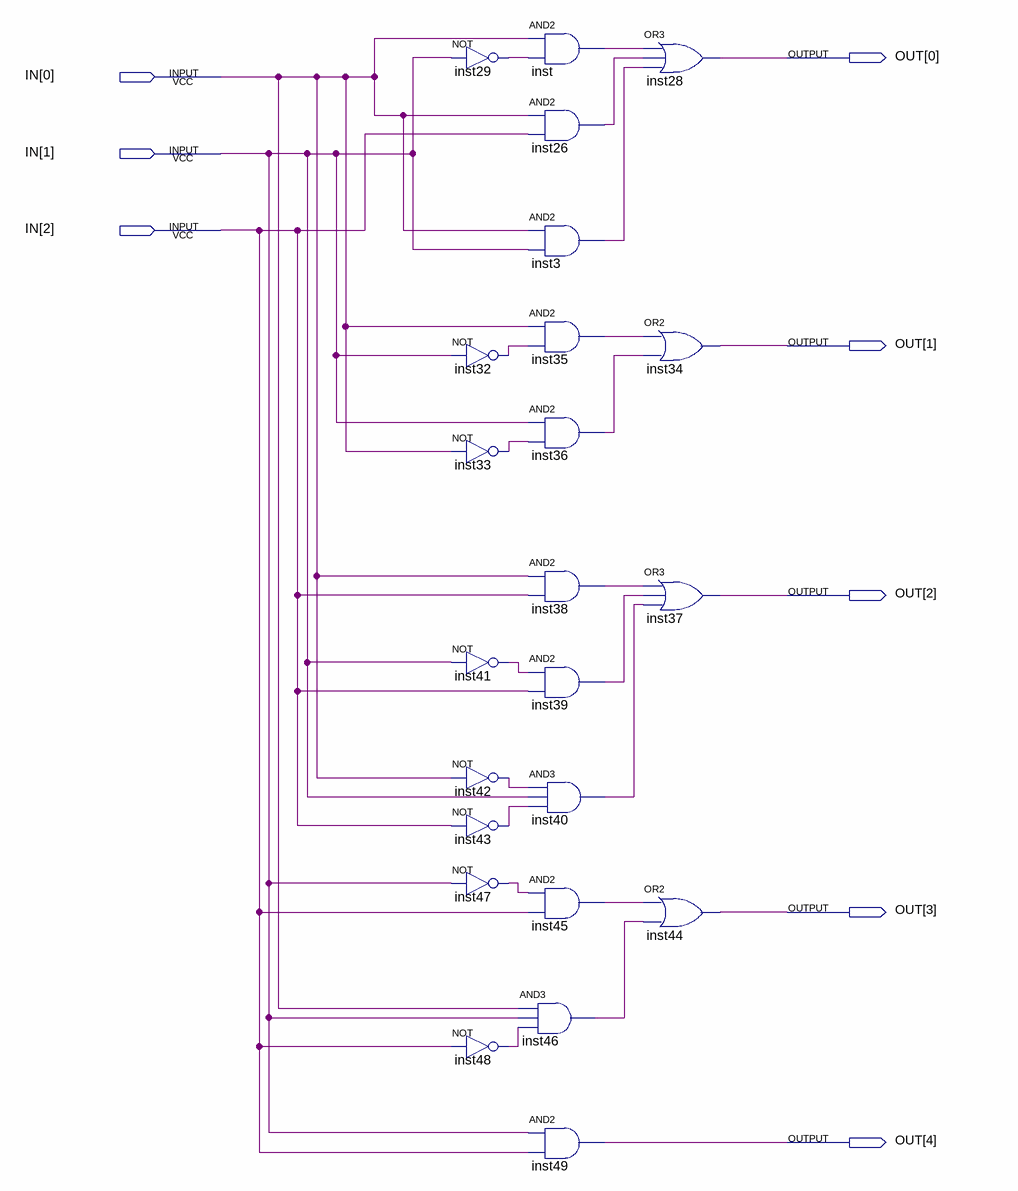
[diagram p0: schematic sheet]
// Quartus schematic HW1.bdf as structural Verilog: 23 symbols, 8 pins
module HW1 (
  input  [2:0] IN,
  output [4:0] OUT
);

  wire inst3_out, inst26_out, inst29_out, inst32_out, inst33_out, inst35_out, inst36_out, inst38_out,
       inst39_out, inst40_out, inst41_out, inst42_out, inst43_out, inst45_out, inst46_out, inst47_out,
       inst48_out, inst_out;

  not inst29 (inst29_out, IN[1]);
  not inst32 (inst32_out, IN[1]);
  not inst33 (inst33_out, IN[0]);
  not inst41 (inst41_out, IN[1]);
  not inst42 (inst42_out, IN[0]);
  not inst43 (inst43_out, IN[2]);
  not inst47 (inst47_out, IN[1]);
  not inst48 (inst48_out, IN[2]);
  and inst (inst_out, IN[0], inst29_out);
  and inst26 (inst26_out, IN[0], IN[2]);
  and inst3 (inst3_out, IN[0], IN[1]);
  and inst35 (inst35_out, IN[0], inst32_out);
  and inst36 (inst36_out, IN[1], inst33_out);
  and inst38 (inst38_out, IN[0], IN[2]);
  and inst39 (inst39_out, inst41_out, IN[2]);
  and inst40 (inst40_out, inst42_out, IN[1], inst43_out);
  and inst45 (inst45_out, inst47_out, IN[2]);
  and inst46 (inst46_out, IN[0], IN[1], inst48_out);
  and inst49 (OUT[4], IN[1], IN[2]);
  or inst28 (OUT[0], inst_out, inst26_out, inst3_out);
  or inst34 (OUT[1], inst35_out, inst36_out);
  or inst37 (OUT[2], inst38_out, inst39_out, inst40_out);
  or inst44 (OUT[3], inst45_out, inst46_out);
endmodule
